# EAGLE schematic Schematic (EAGLE 8.2.2)
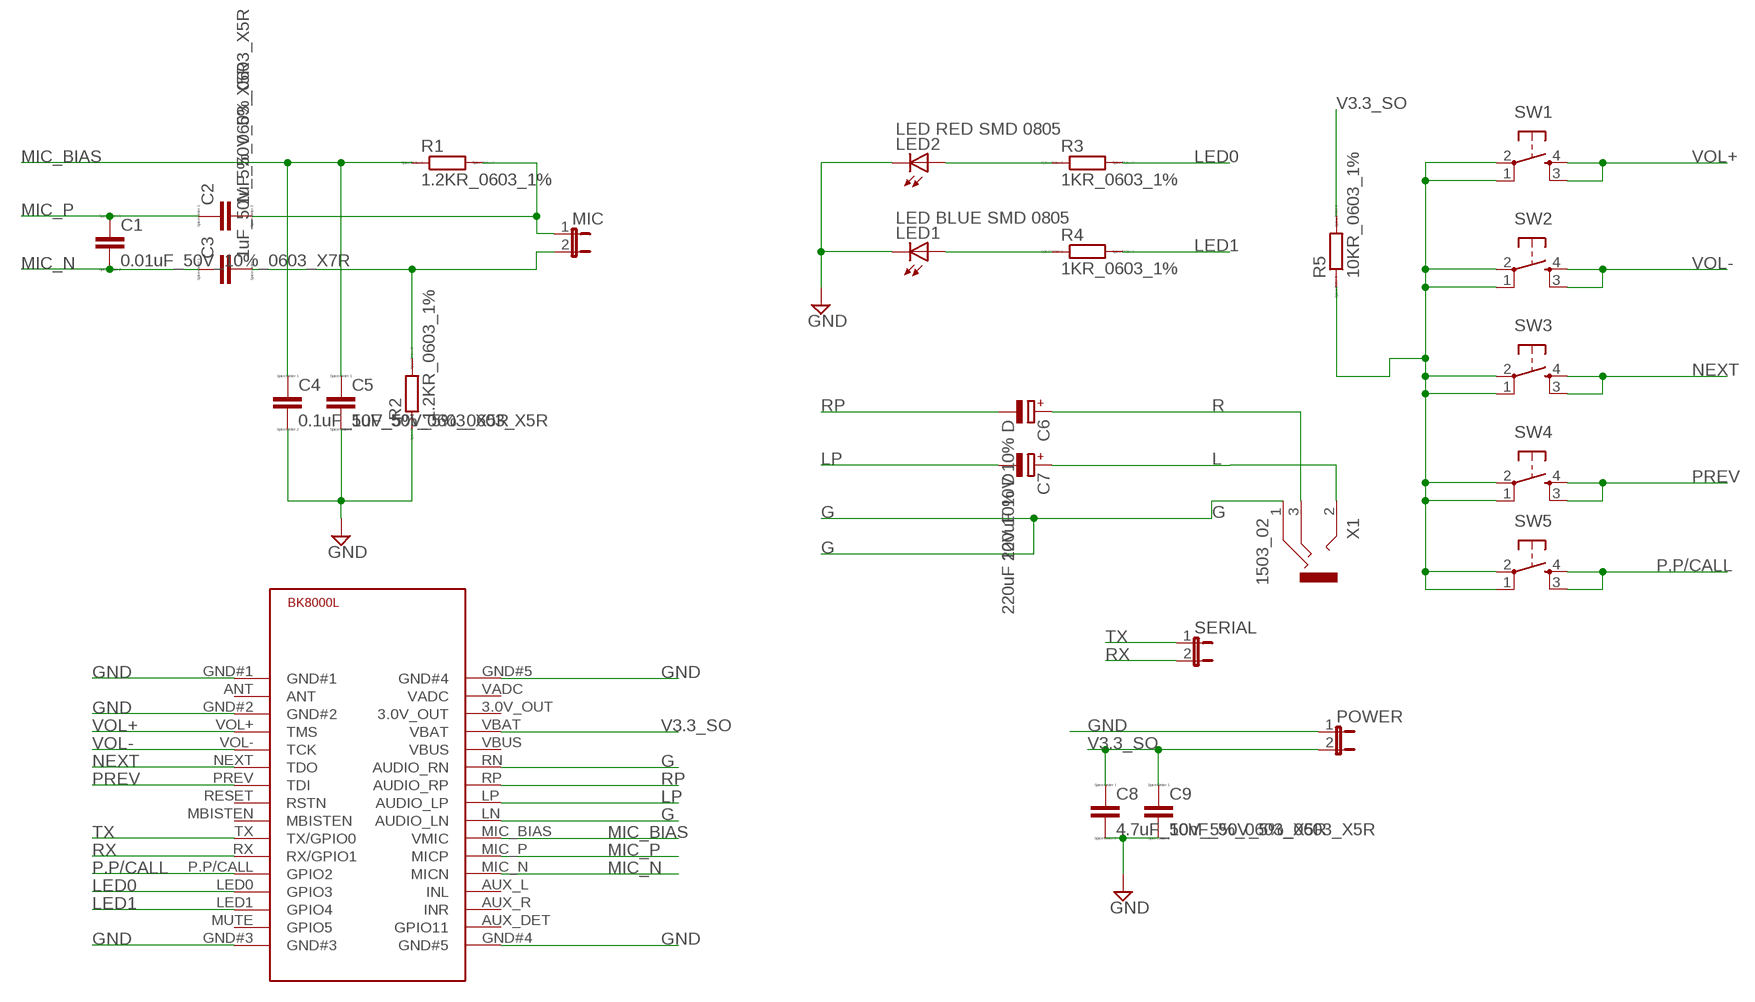
[diagram p0: schematic, sheet 1]

## Parts
C1  0.01uF_50V_10%_0603_X7R  CC0603  [C0603]
C2  1uF_50V_5%_0603_X5R  CC0603  [C0603]
C3  1uF_50V_5%_0603_X5R  CC0603  [C0603]
C4  0.1uF_50V_5%_0603_X5R  CC0603  [C0603]
C5  1uF_50V_5%_0603_X5R  CC0603  [C0603]
C6  220uF 10V 10% D  CPOL-EUSMCD  [SMC_D]
C7  220uF 10V 10% D  CPOL-EUSMCD  [SMC_D]
C8  4.7uF_50V_5%_0603_X5R  CC0603  [C0603]
C9  10nF_50V_5%_0603_X5R  CC0603  [C0603]
LED1  LED BLUE SMD 0805  LEDCHIP-LED0805  [CHIP-LED0805]
LED2  LED RED SMD 0805  LEDCHIP-LED0805  [CHIP-LED0805]
MIC  JP1E  [JP1]
POWER  JP1E  [JP1]
R1  1.2KR_0603_1%  RR0603  [R0603]
R2  1.2KR_0603_1%  RR0603  [R0603]
R3  1KR_0603_1%  RR0603  [R0603]
R4  1KR_0603_1%  RR0603  [R0603]
R5  10KR_0603_1%  RR0603  [R0603]
SERIAL  JP1E  [JP1]
SW1  10-XX4X4SMD  [BT4X4]
SW2  10-XX4X4SMD  [BT4X4]
SW3  10-XX4X4SMD  [BT4X4]
SW4  10-XX4X4SMD  [BT4X4]
SW5  10-XX4X4SMD  [BT4X4]
U$1  BK8000LBK8000L_PAD  [BK8000L]
X1  1503_02  [1503_02]

## Nets
G: U$1.LN(AUDIO_LN) U$1.RN(AUDIO_RN) X1.1
GND: C4.2 C5.2 C8.2 C9.2 LED1.C LED2.C POWER.1 R2.1 U$1.GND#1 U$1.GND#2 U$1.GND#3 U$1.GND#4(GND#5) U$1.GND#5(GND#4)
L: C7.+ X1.2
LED0: R3.2 U$1.LED0(GPIO3)
LED1: R4.2 U$1.LED1(GPIO4)
LP: C7.- U$1.LP(AUDIO_LP)
MIC_BIAS: C4.1 C5.1 R1.1 U$1.MIC_BIAS(VMIC)
MIC_N: C1.2 C3.1 U$1.MIC_N(MICN)
MIC_P: C1.1 C2.1 U$1.MIC_P(MICP)
N$1: LED1.A R4.1
N$2: LED2.A R3.1
N$3: R5.1 SW1.1 SW1.2(P) SW2.1 SW2.2(P) SW3.1 SW3.2(P) SW4.1 SW4.2(P) SW5.1 SW5.2(P)
N$6: C3.2 MIC.2 R2.2
N$7: C2.2 MIC.1 R1.2
NEXT: SW3.3(S1) SW3.4(S) U$1.NEXT(TDO)
P.P/CALL: SW5.3(S1) SW5.4(S) U$1.P.P/CALL(GPIO2)
PREV: SW4.3(S1) SW4.4(S) U$1.PREV(TDI)
R: C6.+ X1.3
RP: C6.- U$1.RP(AUDIO_RP)
RX: SERIAL.2 U$1.RX(RX/GPIO1)
TX: SERIAL.1 U$1.TX(TX/GPIO0)
V3.3_SO: C8.1 C9.1 POWER.2 R5.2 U$1.VBAT
VOL+: SW1.3(S1) SW1.4(S) U$1.VOL+(TMS)
VOL-: SW2.3(S1) SW2.4(S) U$1.VOL-(TCK)
Unconnected: U$1.3.0V_OUT U$1.ANT U$1.AUX_DET(GPIO11) U$1.AUX_L(INL) U$1.AUX_R(INR) U$1.MBISTEN U$1.MUTE(GPIO5) U$1.RESET(RSTN) U$1.VADC U$1.VBUS X1.2@2

## Library data of the parts
C1-C5 C8 C9 = eagle-ltspice:C: CAPACITOR, European symbol; SPICEMODEL: NONE; SPICEPREFIX: C
C6 C7 = resistor:CPOL-EU: POLARIZED CAPACITOR, European symbol
LED1 LED2 = led:LED: LED OSRAM: - CHIPLED LG R971, LG N971, LY N971, LG Q971, LY Q971, LO R971, LY R971 LH N974, LH R974 LS Q976, LO Q976, LY Q976 LO Q996 - Hyper CHIPLED LW Q18S LB Q993, LB Q99A, LB R99A - SideLED LS A670, LO A670, LY A670, LG A670, LP A670 LB A673, LV A673, LT A673, LW A673 LH A674 LY A675 LS A676, LA A676, LO A676, LY A676, LW A676 LS A679, LY A679, LG A679 - Hyper Micro SIDELED® LS Y876, LA Y876, LO Y876, LY Y876 LT Y87S - SmartLED LW L88C, LW L88S LB L89C, LB L89S, LG L890 LS L89K, LO L89K, LY L89K LS L896, LA L896, LO L896, LY L896 - TOPLED LS T670, LO T670, LY T670, LG T670, LP T670 LSG T670, LSP T670, LSY T670, LOP T670, LYG T670 LG T671, LOG T671, LSG T671 LB T673, LV T673, LT T673, LW T673 LH T674 LS T676, LA T676, LO T676, LY T676, LB T676, LH T676, LSB T676, LW T676 LB T67C, LV T67C, LT T67C, LS T67K, LO T67K, LY T67K, LW E67C LS E67B, LA E67B, LO E67B, LY E67B, LB E67C, LV E67C, LT E67C LW T67C LS T679, LY T679, LG T679 LS T770, LO T770, LY T770, LG T770, LP T770 LB T773, LV T773, LT T773, LW T773 LH T774 LS E675, LA E675, LY E675, LS T675 LS T776, LA T776, LO T776, LY T776, LB T776 LHGB T686 LT T68C, LB T68C - Hyper Mini TOPLED® LB M676 - Mini TOPLED Santana® LG M470 LS M47K, LO M47K, LY M47K Source: http://www.osram.convergy.de LUXEON: - LUMILED® LXK2-PW12-R00, LXK2-PW12-S00, LXK2-PW14-U00, LXK2-PW14-V00 LXK2-PM12-R00, LXK2-PM12-S00, LXK2-PM14-U00 LXK2-PE12-Q00, LXK2-PE12-R00, LXK2-PE12-S00, LXK2-PE14-T00, LXK2-PE14-U00 LXK2-PB12-K00, LXK2-PB12-L00, LXK2-PB12-M00, LXK2-PB14-N00, LXK2-PB14-P00, LXK2-PB14-Q00 LXK2-PR12-L00, LXK2-PR12-M00, LXK2-PR14-Q00, LXK2-PR14-R00 LXK2-PD12-Q00, LXK2-PD12-R00, LXK2-PD12-S00 LXK2-PH12-R00, LXK2-PH12-S00 LXK2-PL12-P00, LXK2-PL12-Q00, LXK2-PL12-R00 Source: www.luxeon.com KINGBRIGHT: KA-3528ASYC Source: www.kingbright.com
MIC POWER SERIAL = jumper:JP1E: JUMPER
R1-R5 = eagle-ltspice:R: RESISTOR, European symbol; SPICEMODEL: NONE; SPICEPREFIX: R
SW1-SW5 = buttons:10-XX: OMRON SWITCH
U$1 = BK8000L:BK8000L: BK8000L Bluetooth Audio module.
X1 = con-lumberg:1503_02: Jack connectors according to JISC 6560, 3.5 mm Klinkeneinbaukupplung nach JISC 6560, 3,5 mm, 3-polig/stereo, abgewinkelte Ausführung, Surface-Mount-Technik (SMT) Source: http://www.lumberg.com/Produkte/PDFs/1503_02.pdf; OC_FARNELL: 1216979; OC_NEWARK: unknown